# Altium schematic sheet Demo.SchDoc
size A; SheetNumber: 1; SheetTotal: 1
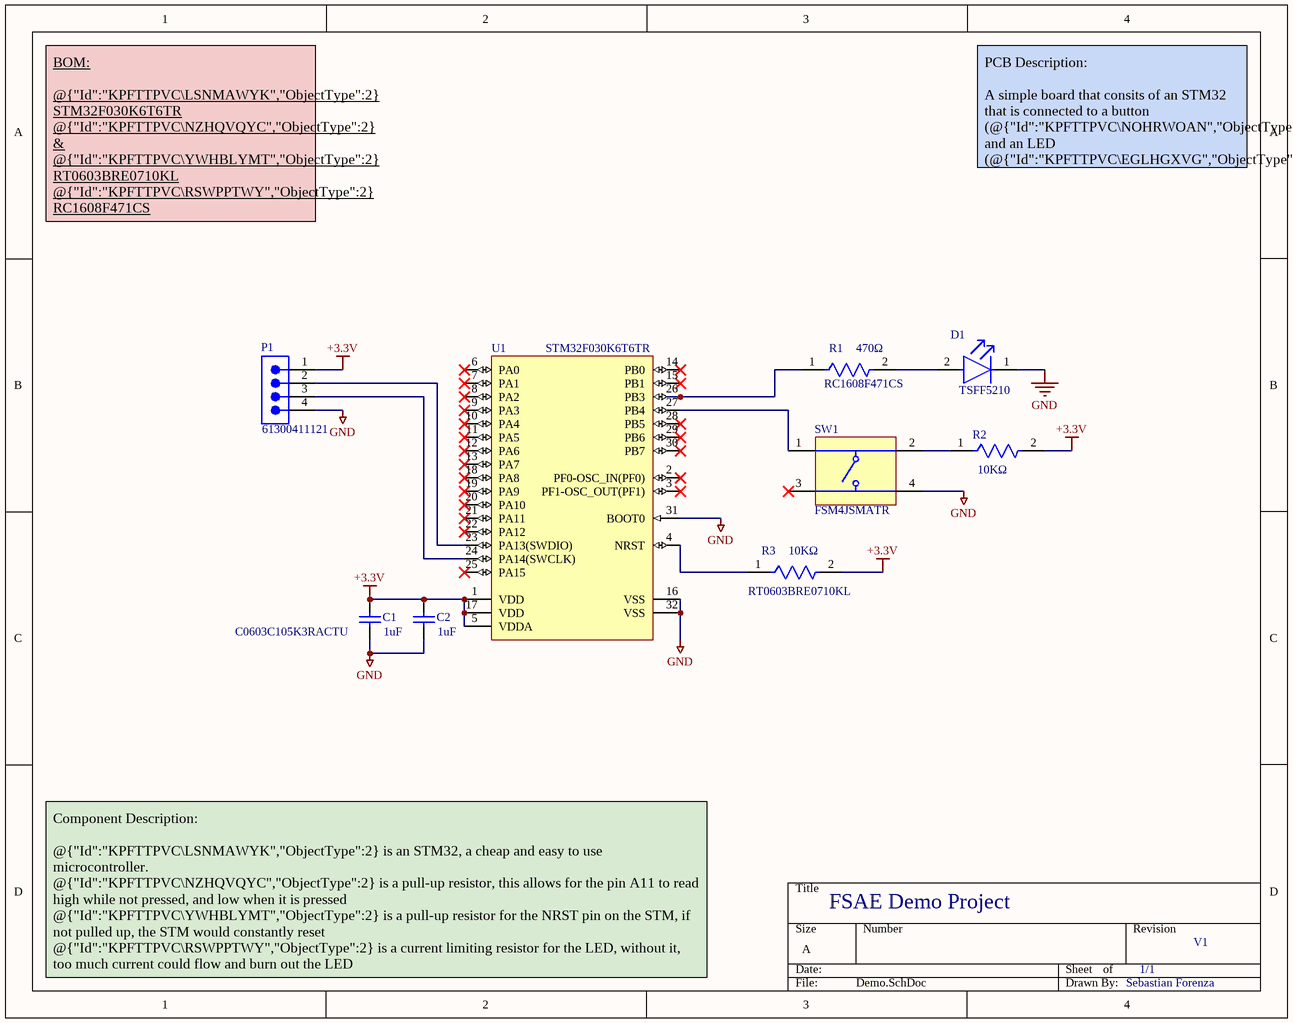
[diagram p0: Demo.SchDoc]

## Parts
C1  C0603C105K3RACTU  Capacitance: 1uF  [CAPC1608X87X35ML15T15]
C2  Capacitance: 1uF  [CAPC1608X87X35ML15T15]  (hidden comment: C0603C105K3RACTU)
D1  TSFF5210  [FP-6_544-5258_09-4-MFG]
P1  61300411121  [61300411121]
R1  RC1608F471CS  Resistance: 470Ω  [FP-RC1608-IPC_A]
R2  Resistance: 10KΩ  [FP-RT0603-IPC_A]  (hidden comment: RT0603BRE0710KL)
R3  RT0603BRE0710KL  Resistance: 10KΩ  [FP-RT0603-IPC_A]
SW1  FSM4JSMATR  [TECO-FSM4JSMATR_V]
U1  STM32F030K6T6TR  [STM-LQFP32_M]

## Nets
+3.3V: C1.2 C2.2 P1.1 R2.2 R3.2 U1.1(VDD) U1.5(VDDA) U1.17(VDD)
GND: C1.1 C2.1 D1.1(C) P1.4 SW1.4 U1.16(VSS) U1.31(BOOT0) U1.32(VSS)
NetD1_2: D1.2(A) R1.2
NetP1_2: P1.2 U1.23(PA13(SWDIO))
NetP1_3: P1.3 U1.24(PA14(SWCLK))
NetR1_1: R1.1 U1.26(PB3)
NetR2_1: R2.1 SW1.2
NetR3_1: R3.1 U1.4(NRST)
NetSW1_1: SW1.1 U1.27(PB4)

Not connected (* = marked no-connect by the designer): SW1 3*; U1 2(PF0-OSC_IN(PF0))* 3(PF1-OSC_OUT(PF1))* 6(PA0)* 7(PA1)* 8(PA2)* 9(PA3)* 10(PA4)* 11(PA5)* 12(PA6)* 13(PA7)* 14(PB0)* 15(PB1)* 18(PA8)* 19(PA9)* 20(PA10)* 21(PA11)* 22(PA12)* 25(PA15)* 28(PB5)* 29(PB6)* 30(PB7)*

## Notes on the sheet
- PCB Description:
  A simple board that consits of an STM32 that is connected to a button (@{"Id":"KPFTTPVC\NOHRWOAN","ObjectType":2}) and an LED (@{"Id":"KPFTTPVC\EGLHGXVG","ObjectType":2}) . Can be programmed with an ST-LINK V2 thru @{"Id":"KPFTTPVC\TKLYTGKY","ObjectType":2}
- BOM:
  @{"Id":"KPFTTPVC\LSNMAWYK","ObjectType":2}                      STM32F030K6T6TR
  @{"Id":"KPFTTPVC\NZHQVQYC","ObjectType":2} & @{"Id":"KPFTTPVC\YWHBLYMT","ObjectType":2}           RT0603BRE0710KL
  @{"Id":"KPFTTPVC\RSWPPTWY","ObjectType":2}                      RC1608F471CS
  @{"Id":"KPFTTPVC\YSKXLKIG","ObjectType":2} & @{"Id":"KPFTTPVC\ZJLRUMKP","ObjectType":2}           C0603C105K3RACTU
  @{"Id":"KPFTTPVC\EGLHGXVG","ObjectType":2}                      TSFF5210
  @{"Id":"KPFTTPVC\TKLYTGKY","ObjectType":2}                       61300411121
  @{"Id":"KPFTTPVC\NOHRWOAN","ObjectType":2}                   FSM4JSMATR
- FSAE Demo Project
- Component Description:
  @{"Id":"KPFTTPVC\LSNMAWYK","ObjectType":2} is an STM32, a cheap and easy to use microcontroller.
  @{"Id":"KPFTTPVC\NZHQVQYC","ObjectType":2} is a pull-up resistor, this allows for the pin A11 to read high while not pressed, and low when it is pressed
  @{"Id":"KPFTTPVC\YWHBLYMT","ObjectType":2} is a pull-up resistor for the NRST pin on the STM, if not pulled up, the STM would constantly reset
  @{"Id":"KPFTTPVC\RSWPPTWY","ObjectType":2} is a current limiting resistor for the LED, without it, too much current could flow and burn out the LED
  @{"Id":"KPFTTPVC\YSKXLKIG","ObjectType":2} & @{"Id":"KPFTTPVC\ZJLRUMKP","ObjectType":2} are for filtering out noise from the 3.3V line, allowing for smooth voltage to the microcontroller
  @{"Id":"KPFTTPVC\EGLHGXVG","ObjectType":2} is an LED that can be turned on from pin A12 of the microcontroller
  @{"Id":"KPFTTPVC\TKLYTGKY","ObjectType":2} is a 4 pin header used for programming and powering the microcontroller
  @{"Id":"KPFTTPVC\NOHRWOAN","ObjectType":2} is a tactile button used for sending high and low signals to the microcontroller
- 1/1
- V1
- Sebastian Forenza

## Library data of the parts
C1 C2 = CMP-2006-03713-1: Manufacturer: Kemet; Part Number: C0603C105K3RACTU
D1 = CMP-00030-41223146-1: TSFF5210 TSFF5210 IR LED, 870nm, T-1 3/4 (5mm) Through Hole package; Number of Elements: 1; Power Dissipation: 180W; Viewing Angle: 20°; Power Rating: 250mW; Test Current: 100mA; Forward Voltage: 1.5V; Lens Style: Circular, Colorless, Diffused, Round; Rise Time: 15ns; Reverse Voltage: 5V; REACH SVHC: Unknown; Packaging: Bulk; Schedule B: 8541402000, 8541402000; Number of LEDs: 1; Mount: Through Hole; Depth: 5.8mm; Max Operating Temperature: 85°C; Radiation Hardening: No; Case/Package: Radial; NexarPartId: 41223146; Lead Free: Lead Free; Number of Pins: 2; Wavelength: 870nm; RoHS: Compliant; Orientation: Top View; Length: 5.8mm; Peak Wavelength: 870nm; Contact Plating: Tin; Min Operating Temperature: -40°C; Forward Current: 100mA
P1 = CMP-1502-01064-3: NexarPartId: 32855522; Operating Supply Voltage: 250V; Pitch: 2.54mm; Contact Resistance: 20mΩ; Number of Positions: 4; Current Rating: 3A; Connector Type: Male Pin; Gender: Male; Contact Plating: Gold; Height: 8.89mm; Lead Pitch: 2.54mm; Lead Free: Lead Free; Contact Mating Length: 5.9944mm; Number of Rows: 1; Termination: Solder; Packaging: Bulk; REACH SVHC: Unknown; Min Operating Temperature: -40°C; RoHS: Compliant; Number of Contacts: 4; Voltage Rating: 250V; Color: Black; Max Operating Temperature: 105°C; Contact Material: Copper; Mount: Through Hole; Orientation: Vertical; Number of Pins: 4
R1 = CMP-13261-005515-1: Res Thick Film 0603 470Ω 1% 0.1W ±100ppm/°C Molded SMD T/R; Max Power Dissipation: 100mW; Voltage Rating (DC): 50V; Case/Package: 0603; Lead Free: Lead Free; Tolerance: 1%; Military Standard: Not; Width: 0.031inch; Height: 0.022inch; Radiation Hardening: No; Contact Plating: Tin; Case Code (Metric): 1608; Min Operating Temperature: -55°C; Number of Terminations: 2; Max Operating Temperature: 155°C; Composition: Thick Film; Case Code (Imperial): 0603; Depth: 0.8mm; Length: 0.063inch; Temperature Coefficient: 100ppm/°C; Packaging: Tape and Reel; Features: Moisture Resistant
R2 R3 = CMP-2000-04517-2: RES SMD 10K OHM 0.1% 1/10W 0603; Manufacturer: Yageo; Tolerance: 0.001; Temperature Coefficient: 50 ppm/°C; Power Rating: 0.1W; Value: 10KΩ; Voltage Rating: 75V; Temperature Range High: +155°C; Device Class L2: Resistors; Temperature: -55°C to +155°C; Series: RT; Device Class L1: Passive Components; Temperature Range Low: -55°C; Automotive: No; Mouser Description: Res Thin Film 0603 10K Ohm 0.1% 1/10W ±50ppm/°C Molded SMD SMD Paper T/R; Device Class L3: Chip SMD Resistors; RoHS: TRUE; Package: RT0603; Footprint Url: http://www.yageo.com/exep/pages/download/literatures/PYu-R_Mount_10.pdf; Octopart: https://octopart.com/rt0603bre0710kl-yageo-1273959; Manufacturer Part Number: RT0603BRE0710KL; ComponentLink2URL: http://www.yageo.com/documents/recent/PYu-RT_1-to-0.01_RoHS_L_9.pdf; Composition: Thin Film; Category: Res; Lead Free: Yes; Height: 0.55mm; Digikey Description: RES SMD 10K OHM 0.1% 1/10W 0603; Ipc Land Pattern Name: RESC16080X45; ComponentLink2Description: Datasheet
SW1 = CMP-2000-07486-1: Micro Miniature Push Button Switch FSM JSM, 50 mA, -35 to 85 degC, 4-Pin SMD, RoHS, Tape and Reel; Manufacturer: TE Connectivity; Mechanical Life: 100000Cycles; Current Rating: 50mA; Actuator Material: Polyamide; Max Voltage Rating (DC): 12V; Capacitance: 0f; Illumination Type: Illuminated; Voltage Rating (DC): 24V; Case\/Package: SMD/SMT; Operating Force: 160gf; Contact Resistance: 100mOhm; Actuator Length: 0.055inch; Switch Travel: 0.25mm; Throw Configuration: SPST; Termination: GullWing; Contact Plating: Silver; Orientation: Straight; Mounting Technology: SurfaceMount; REACH SVHC: Unknown; Electrical Life: 100000Cycles; Package Reference: FSM4JSMATR; Max Operating Temperature: 85degC; Manufacturer URL: http://www.te.com/; Package Description: 4-Pin Surface Mount Device, Body 6 x 6 mm, Pitch 4.5 mm; Datasheet Version: Rev. V, 02/2015; Packaging: TapeandReel; Min Operating Temperature: -35degC; Mount: SurfaceMount; Contact Current Rating: 50mA; Contact Material: CopperAlloy; Package Quantity: 1200; Datasheet URL: http://www.te.com/commerce/DocumentDelivery/DDEController?Action=showdoc&DocId=Customer+Drawing%7F2-1437565-7%7FV%7Fpdf%7FEnglish%7FENG_CD_2-1437565-7_V.pdf%7F4-1437565-2; RoHSCompliant: true
U1 = CMP-0304-00067-2: ARM Cortex-M0 32-bit MCU, 32 KB Flash, 4 KB Internal RAM, 26 I/Os, 32-Pin LQFP, -40 to 85 degC, Tape and Reel; Manufacturer: STMicroelectronics; Operating Frequency(F) (Processor speed) (MHz): 48; I/Os (High Current): 26; FLASH Size (Prog) (kB): 32; Supply Voltage(Vcc) min (V): 2.4; Internal RAM Size (kB): 4; Core: ARM Cortex-M0; Package Reference: LQFP32; Mounting Technology: Surface Mount; ComponentLink2URL: http://www.st.com/st-web-ui/static/active/en/resource/technical/document/datasheet/DM00088500.pdf; ComponentLink1URL: http://www.st.com/; Packing: Tape and Reel; Package Description: 32-Pin Low Profile Quad Flat Package, 7 x 7 mm Body, 0.8 mm Pitch; ComponentLink2Description: Datasheet; ComponentLink1Description: Manufacturer URL; DatasheetVersion: Rev. 2; PartNumber: STM32F030K6T6TR